# EAGLE design z0-probe-v7 (EAGLE 9.4.1)
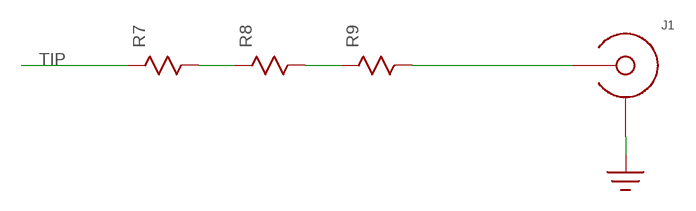
[diagram p0: schematic, sheet 1]

## Parts
J1  SMA-EDGE-LAUNCH  [SMA_EDGE_LAUNCH_2L_4020_TAPER_FIXED]
R7  R0603-TIGHT  [0603_TIGHT]
R8  R0603-TIGHT  [0603_TIGHT]
R9  R0603-TIGHT  [0603_TIGHT]

## Nets
GND: J1.BOTTOM_GND(SHIELD) J1.GND@1(SHIELD) J1.GND@2(SHIELD) J1.GND@3(SHIELD) J1.GND@4(SHIELD) J1.GND@5(SHIELD) J1.GND@6(SHIELD) J1.GND@7(SHIELD) J1.GND@8(SHIELD) J1.GND@14(SHIELD) J1.GND@15(SHIELD) J1.GND@16(SHIELD) J1.GND@17(SHIELD) J1.GND_PAD1(SHIELD) J1.GND_PAD2(SHIELD) J1.P$1(SHIELD) J1.P$2(SHIELD)
N$7: R7.P$2 R8.P$1
N$8: R8.P$2 R9.P$1
N$9 [50-ohm]: J1.CENTER@1(CENTER) J1.P$3(CENTER) R9.P$2
TIP: R7.P$1

## Library data of the parts
J1 = sma_footprint_2l:SMA-EDGE-LAUNCH
R7-R9 = yapo:R

## Net classes
1 50-ohm: width 0.775 mm, clearance 0.152 mm

## Board
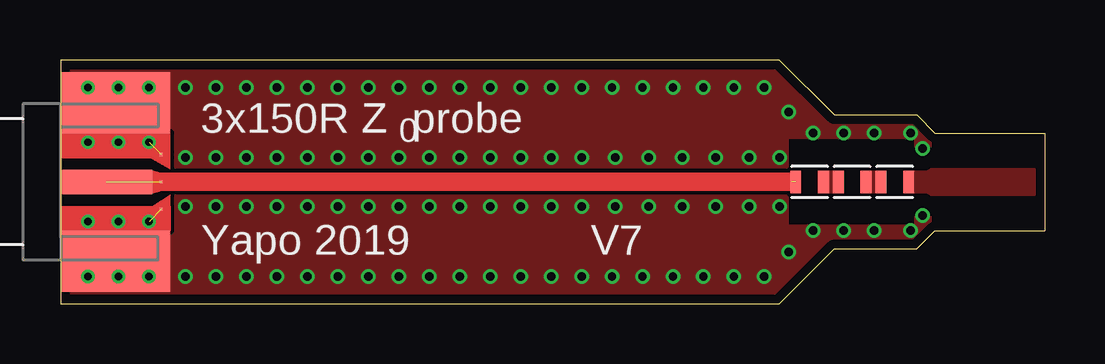
[diagram p1: board, top side]
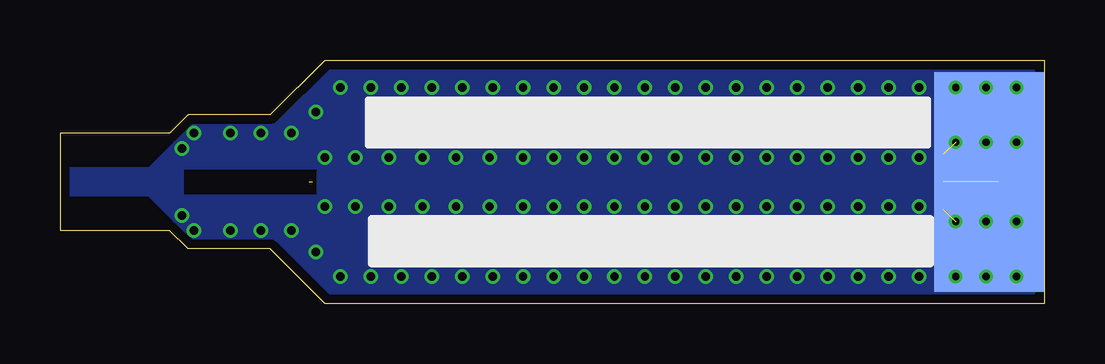
[diagram p2: board, bottom side, seen from below]

Size 41.02 x 10.16 mm. Coordinates in mm from the lower left corner, seen from the top.
Outline: 0,0 29.97,0 32.26,2.29 35.69,2.29 36.45,3.05 41.02,3.05 41.02,7.11 36.45,7.11 35.69,7.87 32.26,7.87 29.97,10.16 0,10.16 0,0
Copper layers (1*16): Top 0.035559375mm / dielectric 1.6mm / Bottom 0.035559375mm
Design rules "oshpark-2layer *": minimum track width 6mil, minimum drill 10mil, track to track 6mil, track to pad 6mil, pad to pad 6mil, via to via 6mil, smd to smd 6mil, copper to edge 15mil, drill to drill 6mil, minimum pad ring 5mil, minimum via ring 5mil, stop-mask expansion 2.5mil, vias tented up to drill 20mil, thermal gap 10mil

### Footprints (pad centres in the part's own frame; a part is rotated, then mirrored left to right if it is on the bottom)
SMA_EDGE_LAUNCH_2L_4020_TAPER_FIXED = smd 4.572 x 9.144 bottom: BOTTOM_GND 2.286,0 | smd 3.81 x 1.016: CENTER@1 1.905,0 | drill 0.3: GND@1 1.143,3.937; GND@2 3.683,3.937; GND@3 1.143,1.651; GND@4 3.683,1.651; GND@5 1.143,-1.651; GND@6 3.683,-1.651; GND@7 1.143,-3.937; GND@8 3.683,-3.937; GND@14 2.413,3.937; GND@15 2.413,-3.937; GND@16 2.413,-1.651; GND@17 2.413,1.651 | smd 4.572 x 2.54: GND_PAD1 2.286,3.302; GND_PAD2 2.286,-3.302 | smd 0.127 x 0.127: P$1 4.191,1.143; P$2 4.191,-1.143; P$3 4.191,0
0603_TIGHT = smd 0.45 x 0.95: P$1 -0.575,0; P$2 0.575,0

### Placement (x,y rotation side)
J1  0,5.08 0 top
R7  34.77,5.08 180 top
R8  32.99,5.08 180 top
R9  31.22,5.08 180 top

### Tracks (layer width: path | path; a pad name or v marks a point on that pad's centre or on a via)
GND  (via drill 0.35)  (2 unrouted)
  other vias: 31.37,7.11 32.64,7.11 33.91,7.11 35.43,7.11 31.37,3.05 32.64,3.05 33.91,3.05 35.43,3.05 30.35,8 30.35,2.16 35.94,6.48 35.94,3.68 11.56,6.1 12.83,6.1 14.1,6.1 15.37,6.1 16.64,6.1 17.91,6.1 19.18,6.1 20.45,6.1 21.72,6.1 23.11,6.1 24.51,6.1 25.91,6.1 27.3,6.1 28.7,6.1 11.56,4.06 12.83,4.06 14.1,4.06 15.37,4.06 16.64,4.06 17.91,4.06 19.18,4.06 20.45,4.06 21.72,4.06 23.11,4.06 24.51,4.06 25.91,4.06 27.3,4.06 28.7,4.06 11.56,9.02 12.83,9.02 14.1,9.02 15.37,9.02 16.64,9.02 17.91,9.02 19.18,9.02 20.45,9.02 21.72,9.02 22.99,9.02 24.26,9.02 25.53,9.02 26.8,9.02 28.07,9.02 29.34,9.02 11.56,1.14 12.83,1.14 14.1,1.14 15.37,1.14 16.64,1.14 17.91,1.14 19.18,1.14 20.45,1.14 21.72,1.14 22.99,1.14 24.26,1.14 25.53,1.14 26.8,1.14 28.07,1.14 29.34,1.14 5.21,6.1 6.48,6.1 7.75,6.1 9.02,6.1 10.29,6.1 5.21,9.02 6.48,9.02 7.75,9.02 9.02,9.02 10.29,9.02 5.21,1.14 6.48,1.14 7.75,1.14 9.02,1.14 10.29,1.14 5.21,4.06 6.48,4.06 7.75,4.06 9.02,4.06 10.29,4.06 29.97,6.1 29.97,4.06
  pour Top (isolate 0.152, rank 2, no thermals): 0,10.16 41.02,10.16 41.02,0 0,0
  pour Bottom: 0,0 41.02,0 41.02,10.16 0,10.16
  cutout Top: 30.35,6.83 30.35,5.61 35.56,5.61 35.56,6.83
  cutout Top: 35.56,5.71 40.64,5.71 40.64,7.11 36.32,7.11 36.32,6.48 35.56,6.48
  cutout Top: 35.56,4.45 35.56,3.68 36.32,3.68 36.32,3.05 40.64,3.05 40.64,4.45
  cutout Top: 30.35,4.55 30.35,3.33 35.56,3.33 35.56,4.55
  cutout Bottom: 35.81,5.59 30.35,5.59 30.35,4.57 35.81,4.57
  cutout Bottom: 36.32,6.73 37.34,5.71 40.64,5.71 40.64,7.11 36.32,7.11
  cutout Bottom: 36.32,3.05 36.32,3.43 37.34,4.45 40.64,4.45 40.64,3.05
N$7
  pour Top (no thermals): 33.5,4.67 34.14,4.67 34.14,5.49 33.5,5.49
N$8
  pour Top (no thermals): 31.83,4.67 32.38,4.67 32.38,5.49 31.83,5.49
N$9  (2 unrouted)
  Top 0.775: 30.48,5.08 J1.P$3
TIP
  pour Top (no thermals): 35.31,5.49 35.31,4.67 36.15,4.67 36.32,4.57 40.64,4.57 40.64,5.59 36.32,5.59 36.15,5.49

### Text on the board
tPlace: 3x150R Z probe | 0 | Yapo 2019 | V7